# Altium schematic sheet USB_HUB.SchDoc
size A4
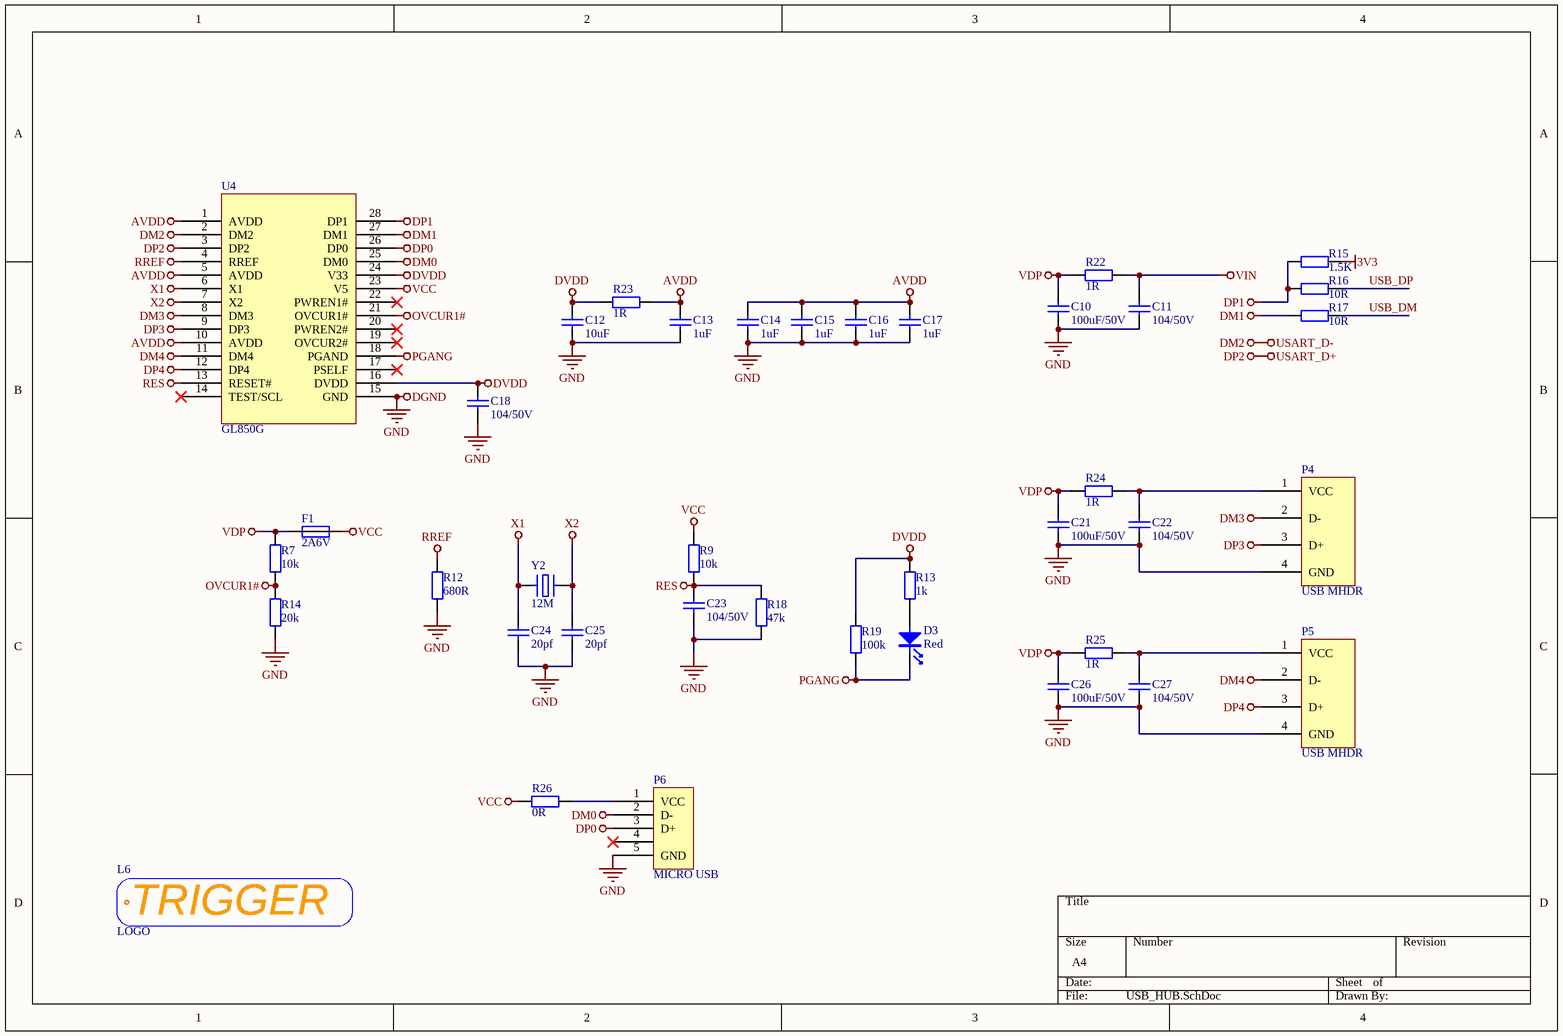
[diagram p0: USB_HUB.SchDoc]

## Parts
C10  _Parameter: 100uF/50V  [电容_C1206]  (hidden comment: 100uF)
C11  _Parameter: 104/50V  [电容_C0603]  (hidden comment: 104)
C12  _Parameter: 10uF  [电容_C0603]  (hidden comment: 20PF)
C13  _Parameter: 1uF  [电容_C0603]  (hidden comment: 20PF)
C14  _Parameter: 1uF  [电容_C0603]  (hidden comment: 20PF)
C15  _Parameter: 1uF  [电容_C0603]  (hidden comment: 20PF)
C16  _Parameter: 1uF  [电容_C0603]  (hidden comment: 20PF)
C17  _Parameter: 1uF  [电容_C0603]  (hidden comment: 20PF)
C18  _Parameter: 104/50V  [电容_C0603]  (hidden comment: 104)
C21  _Parameter: 100uF/50V  [电容_C1206]  (hidden comment: 100uF)
C22  _Parameter: 104/50V  [电容_C0603]  (hidden comment: 104)
C23  _Parameter: 104/50V  [电容_C0603]  (hidden comment: 104)
C24  20PF  [电容_C0603]
C25  20PF  [电容_C0603]
C26  _Parameter: 100uF/50V  [电容_C1206]  (hidden comment: 100uF)
C27  _Parameter: 104/50V  [电容_C0603]  (hidden comment: 104)
D3  Red  [LED_0603]
F1  2A6V  [电阻_R1206]
L6  LOGO  [LOGO L BS]
P4  USB MHDR  [接插件_USB母座 前贴后插 卷边 短体10]
P5  USB MHDR  [接插件_USB母座 前贴后插 卷边 短体10]
P6  MICRO USB  [接插件_MICRO 牛角插座 USB 直边]
R7  10k  [电阻_R0603]
R9  10k  [电阻_R0603]
R12  680R  [电阻_R0603]
R13  1k  [电阻_R0603]
R14  20k  [电阻_R0603]
R15  1.5K  [电阻_R0603]
R16  10R  [电阻_R0603]
R17  10R  [电阻_R0603]
R18  47k  [电阻_R0603]
R19  100k  [电阻_R0603]
R22  1R  [电阻_R0603]
R23  1R  [电阻_R0603]
R24  1R  [电阻_R0603]
R25  1R  [电阻_R0603]
R26  0R  [电阻_R0603]
U4  GL850G  [SSOP28]
Y2  12M  [晶振_3225]

## Nets
3V3: R15.1
AVDD: C13.2 C14.2 C15.2 C16.2 C17.2 R23.2 U4.1(AVDD) U4.5(AVDD) U4.10(AVDD)
DGND: C10.1 C11.1 C12.1 C13.1 C14.1 C15.1 C16.1 C17.1 C18.1 C21.1 C22.1 C23.1 C24.1 C25.1 C26.1 C27.1 P4.0(GND) P4.4(GND) P5.0(GND) P5.4(GND) P6.0 P6.5(GND) R12.1 R14.1 R18.1 U4.15(GND) Y2.0  [also labelled GND]
DM0: P6.2(D-) U4.25(DM0)
DM1: R17.2 U4.27(DM1)
DM2: U4.2(DM2)  [also labelled USART_D-]
DM3: P4.2(D-) U4.8(DM3)
DM4: P5.2(D-) U4.11(DM4)
DP0: P6.3(D+) U4.26(DP0)
DP1: R15.2 R16.2 U4.28(DP1)
DP2: U4.3(DP2)  [also labelled USART_D+]
DP3: P4.3(D+) U4.9(DP3)
DP4: P5.3(D+) U4.12(DP4)
DVDD: C12.2 C18.2 R13.2 R19.2 R23.1 U4.16(DVDD) U4.24(V33)
OVCUR1#: R7.1 R14.2 U4.21(OVCUR1#)
PGANG: D3.K R19.1 U4.18(PGAND)
RES: C23.2 R9.1 R18.2 U4.13(RESET#)
RREF: R12.2 U4.4(RREF)
VCC: F1.2 R9.2 R26.1 U4.23(V5)
VDP: C10.2 C21.2 C26.2 F1.1 R7.2 R22.1 R24.1 R25.1
VIN: C11.2 R22.2
X1: C24.2 U4.6(X1) Y2.1
X2: C25.2 U4.7(X2) Y2.2
USB_DM: R17.1
USB_DP: R16.1
NetC22_2: C22.2 P4.1(VCC) R24.2
NetC27_2: C27.2 P5.1(VCC) R25.2
NetD3_A: D3.A R13.1
NetP6_1: P6.1(VCC) R26.2

Not connected (* = marked no-connect by the designer): P6 4*; U4 14(TEST/SCL)* 17(PSELF)* 19(OVCUR2#)* 20(PWREN2#)* 22(PWREN1#)*

## Notes on the sheet
- (in symbol LOGO_TRIGGER) TRIGGER

## Library data of the parts
C10 C21 C26 = Cap: _Material: X7R; _Voltage: 50V; _Slash: /; _Specification: Cap,0805,X7R,100uF,50V,10%; _Comma: ,; _Accuracy: 10%; _Footprint: 0805; _Capacitance: 100uF; _Name: Cap
C11 C18 C22 C23 C27 = Cap: _Material: X7R; _Voltage: 50V; _Slash: /; _Specification: Cap,0805,X7R,104,50V,10%; _Comma: ,; _Accuracy: 10%; _Footprint: 0805; _Capacitance: 104; _Name: Cap
C12-C17 C24 C25 = Cap: _Material: X7R; _Voltage: 50V; _Slash: /; _Specification: Cap,0805,X7R,20PF,50V,10%; _Comma: ,; _Accuracy: 10%; _Footprint: 0805; _Capacitance: 20PF; _Name: Cap
  C24 C25: _Parameter: 20pf
D3 = LED: _Comma: ,; _Footprint: 0603; _Specification: LED,0603,Red; _Name: LED; _Color: Red
F1 = Fuse: _Comma: ,; _Footprint: D5*20; _Specification: Fuse,*,D5*20,2A6V; _Model: *; _Name: Fuse; _Current: 2A6V
L6 = LOGO_TRIGGER
P4 P5 = USB MHDR: _Comma: ,; _Name: Port; _Specification: Port,USB MHDR,AF,90°; _Value: AF,90°; _Model: USB MHDR
P6 = MICRO USB 5PIN: _Comma: ,; _Name: Port; _Specification: Port,MICRO USB,5PIN; _Value: 5PIN; _Model: MICRO USB
R7 R9 = Res: _Accuracy: 1%; _Power: 1/8W; _Footprint: 0805; _Drift: 100ppm; _Comma: ,; _Specification: Res,0805,10k,1%,1/8W,100ppm; _Name: Res; _Value: 10k
R12 = Res: _Accuracy: 1%; _Power: 1/8W; _Footprint: 0805; _Drift: 100ppm; _Comma: ,; _Specification: Res,0805,680R,1%,1/8W,100ppm; _Name: Res; _Value: 680R
R13 = Res: _Accuracy: 1%; _Power: 1/8W; _Footprint: 0805; _Drift: 100ppm; _Comma: ,; _Specification: Res,0805,1k,1%,1/8W,100ppm; _Name: Res; _Value: 1k
R14 = Res: _Accuracy: 1%; _Power: 1/8W; _Footprint: 0805; _Drift: 100ppm; _Comma: ,; _Specification: Res,0805,20k,1%,1/8W,100ppm; _Name: Res; _Value: 20k
R15-R17 = Res: P: 1/8W; 参数: Res,0805,0R,±1%,1/8W,100ppm,155C
  R15: R: 1.5K
  R16 R17: R: 10R
R18 = Res: _Accuracy: 1%; _Power: 1/8W; _Footprint: 0805; _Drift: 100ppm; _Comma: ,; _Specification: Res,0805,47k,1%,1/8W,100ppm; _Name: Res; _Value: 47k
R19 = Res: _Accuracy: 1%; _Power: 1/8W; _Footprint: 0805; _Drift: 100ppm; _Comma: ,; _Specification: Res,0805,100k,1%,1/8W,100ppm; _Name: Res; _Value: 100k
R22-R25 = Res: _Accuracy: 1%; _Power: 1/8W; _Footprint: 0805; _Drift: 100ppm; _Comma: ,; _Specification: Res,0805,1R,1%,1/8W,100ppm; _Name: Res; _Value: 1R
R26 = Res: _Accuracy: 1%; _Power: 1/8W; _Footprint: 0805; _Drift: 100ppm; _Comma: ,; _Specification: Res,0805,0R,1%,1/8W,100ppm; _Name: Res; _Value: 0R
U4 = GL850G: USBHUB
Y2 = XTAL_B: _Comma: ,; _Footprint: 5032; _Name: CRYSTALS; _Specification: CRYSTALS,12M,5032,10ppm,12pF; _Accuracy: 10ppm; _CL: 12pF; _Frequency: 12M